# EAGLE design hw2 (EAGLE 8.7.1)
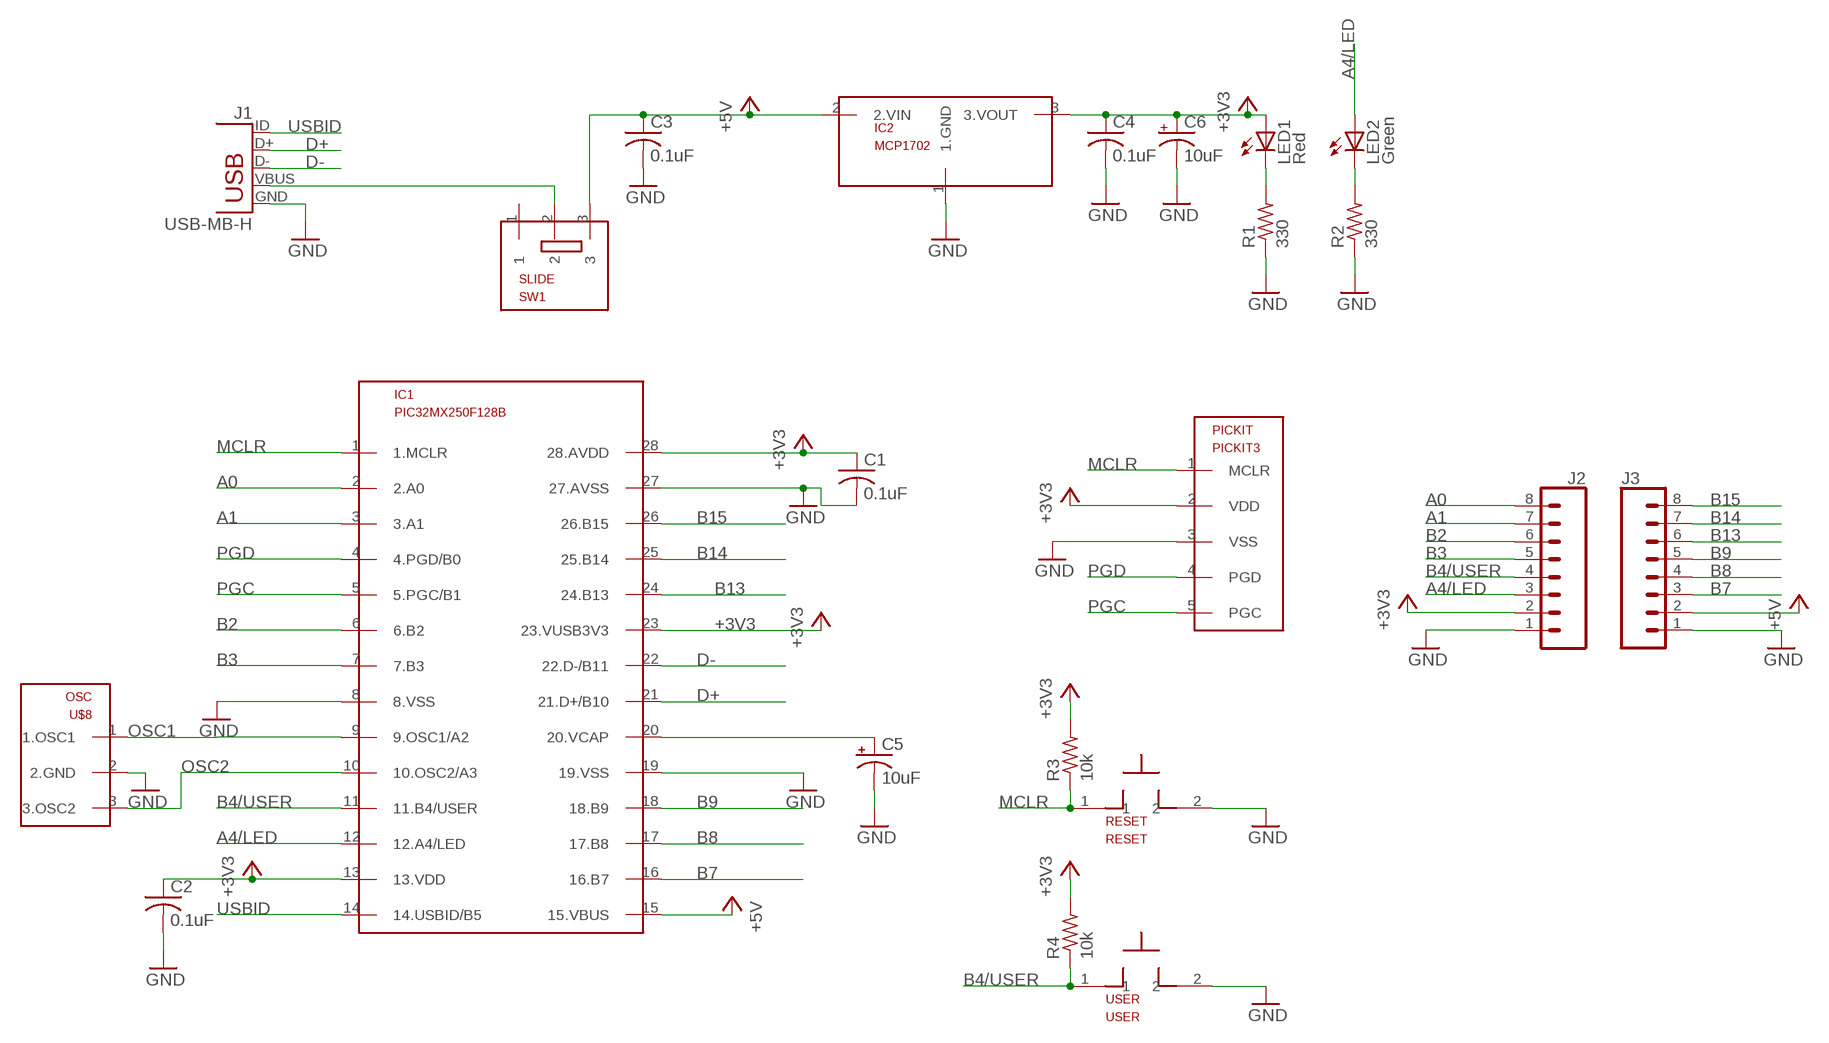
[diagram p0: schematic, sheet 1]

## Parts
C1  0.1uF  C-US025-025X050  [C025-025X050]
C2  0.1uF  C-US025-025X050  [C025-025X050]
C3  0.1uF  C-US025-025X050  [C025-025X050]
C4  0.1uF  C-US025-025X050  [C025-025X050]
C5  10uF  CPOL-USB45181B  [B45181B]
C6  10uF  CPOL-USB45181B  [B45181B]
IC1  PIC32MX250F128B  [DIL28-3]
IC2  MCP1702  [TO92]
J1  USB-MB-H  [USB-MB-H]
J2  CONN_08"  [1X08]
J3  CONN_08"  [1X08]
LED1  Red  LED3MM  [LED3MM]
LED2  Green  LED3MM  [LED3MM]
PICKIT  PICKIT3  [1X05]
R1  330  R-US_0207/10  [0207/10]
R2  330  R-US_0207/10  [0207/10]
R3  10k  R-US_0207/10  [0207/10]
R4  10k  R-US_0207/10  [0207/10]
RESET  RESET  PB  [PB]
SW1  SLIDE  [SLIDE]
U$8  OSC  [OSC]
USER  USER  PB  [PB]

## Nets
+3V3: C1.1 C2.1 C4.1 C6.+ IC1.13(13.VDD) IC1.23(23.VUSB3V3) IC1.28(28.AVDD) IC2.3(3.VOUT) J2.2 LED1.A PICKIT.2(VDD) R3.2 R4.2
+5V: C3.1 IC1.15(15.VBUS) IC2.2(2.VIN) J3.2 SW1.3
A0: IC1.2(2.A0) J2.8
A1: IC1.3(3.A1) J2.7
A4/LED: IC1.12(12.A4/LED) J2.3 LED2.A
B2: IC1.6(6.B2) J2.6
B3: IC1.7(7.B3) J2.5
B4/USER: IC1.11(11.B4/USER) J2.4 R4.1 USER.1
B7: IC1.16(16.B7) J3.3
B8: IC1.17(17.B8) J3.4
B9: IC1.18(18.B9) J3.5
B13: IC1.24(24.B13) J3.6
B14: IC1.25(25.B14) J3.7
B15: IC1.26(26.B15) J3.8
D+: IC1.21(21.D+/B10) J1.D+
D-: IC1.22(22.D-/B11) J1.D-
GND: C1.2 C2.2 C3.2 C4.2 C5.- C6.- IC1.8(8.VSS) IC1.19(19.VSS) IC1.27(27.AVSS) IC2.1(1.GND) J1.GND J2.1 J3.1 PICKIT.3(VSS) R1.1 R2.1 RESET.2 U$8.2(2.GND) USER.2
MCLR: IC1.1(1.MCLR) PICKIT.1(MCLR) R3.1 RESET.1
N$3: J1.VBUS SW1.2
N$5: LED1.K(C) R1.2
N$6: LED2.K(C) R2.2
N$28: C5.+ IC1.20(20.VCAP)
OSC1: IC1.9(9.OSC1/A2) U$8.1(1.OSC1)
OSC2: IC1.10(10.OSC2/A3) U$8.3(3.OSC2)
PGC: IC1.5(5.PGC/B1) PICKIT.5(PGC)
PGD: IC1.4(4.PGD/B0) PICKIT.4(PGD)
USBID: IC1.14(14.USBID/B5) J1.ID
Unconnected: SW1.1

## Library data of the parts
C1-C4 = hw2:C-US: CAPACITOR, American symbol
C5 C6 = hw2:CPOL-US: POLARIZED CAPACITOR, American symbol
IC1 = hw2:PIC32MX250F128B
IC2 = hw2:MCP1702
J1 = hw2:USB: USB Connectors USB-B-PTH is fully proven SKU : PRT-00139/CONN-08278 USB-miniB is fully proven SKU : PRT-00587 USB-A-PCB is untested. USB-A-H is throughly reviewed, but untested. Spark Fun Electronics SKU : PRT-00437 USB-B-SMT is throughly reviewed, but untested. Needs silkscreen touching up. USB-A-S has not been used/tested USB-MB-H has not been used/tested USB-MICROB has been used. CONN-09505
J2 J3 = hw2:CONN_08: Multi connection point. Often used as Generic Header-pin footprint for 0.1 inch spaced/style header connections On any of the 0.1 inch spaced packages, you can populate with these: Break Away Headers - Straight <https://www.sparkfun.com/products/116> (PRT-00116) Break Away Male Headers - Right Angle <https://www.sparkfun.com/products/553> (PRT-00553) Female Headers <https://www.sparkfun.com/products/115> (PRT-00115) Break Away Headers - Machine Pin <https://www.sparkfun.com/products/117> (PRT-00117) Break Away Female Headers - Swiss Machine Pin <https://www.sparkfun.com/products/743> (PRT-00743) Arduino Stackable Header - 8 Pin <https://www.sparkfun.com/products/9279> (PRT-09279) For SCREWTERMINALS and SPRING TERMINALS visit here: Screw Terimnals on SparkFun.com <https://www.sparkfun.com/search/results?term=Screw+Terminals> (5mm/3.5mm/2.54mm spacing) This device is also useful as a general connection point to wire up your design to another part of your project. Our various solder wires solder well into these plated through hole pads. Hook-Up Wire - Assortment (Stranded, 22 AWG) <https://www.sparkfun.com/products/11375> (PRT-11375) Hook-Up Wire - Assortment (Solid Core, 22 AWG) <https://www.sparkfun.com/products/11367> (PRT-11367) View the entire wire category on our website here <https://www.sparkfun.com/categories/141> Special notes: Molex polarized connector foot print use with SKU : PRT-08231 with associated crimp pins and housings. 1MM SMD Version SKU: PRT-10208 NOTES ON THE VARIANTS LOCK and LOCK_LONGPADS... This footprint was designed to help hold the alignment of a through-hole component (i.e. 6-pin header) while soldering it into place. You may notice that each hole has been shifted either up or down by 0.005 of an inch from it's more standard position (which is a perfectly straight line). This slight alteration caused the pins (the squares in the middle) to touch the edges of the holes. Because they are alternating, it causes a "brace" to hold the component in place. 0.005 has proven to be the perfect amount of "off-center" position when using our standard breakaway headers. Although looks a little odd when you look at the bare footprint, once you have a header in there, the alteration is very hard to notice. Also,if you push a header all the way into place, it is covered up entirely on the bottom side.; PROD_ID: CONN-08438
LED1 LED2 = hw2:LED: LED OSRAM: - CHIPLED LG R971, LG N971, LY N971, LG Q971, LY Q971, LO R971, LY R971 LH N974, LH R974 LS Q976, LO Q976, LY Q976 LO Q996 - Hyper CHIPLED LW Q18S LB Q993, LB Q99A, LB R99A - SideLED LS A670, LO A670, LY A670, LG A670, LP A670 LB A673, LV A673, LT A673, LW A673 LH A674 LY A675 LS A676, LA A676, LO A676, LY A676, LW A676 LS A679, LY A679, LG A679 - Hyper Micro SIDELED® LS Y876, LA Y876, LO Y876, LY Y876 LT Y87S - SmartLED LW L88C, LW L88S LB L89C, LB L89S, LG L890 LS L89K, LO L89K, LY L89K LS L896, LA L896, LO L896, LY L896 - TOPLED LS T670, LO T670, LY T670, LG T670, LP T670 LSG T670, LSP T670, LSY T670, LOP T670, LYG T670 LG T671, LOG T671, LSG T671 LB T673, LV T673, LT T673, LW T673 LH T674 LS T676, LA T676, LO T676, LY T676, LB T676, LH T676, LSB T676, LW T676 LB T67C, LV T67C, LT T67C, LS T67K, LO T67K, LY T67K, LW E67C LS E67B, LA E67B, LO E67B, LY E67B, LB E67C, LV E67C, LT E67C LW T67C LS T679, LY T679, LG T679 LS T770, LO T770, LY T770, LG T770, LP T770 LB T773, LV T773, LT T773, LW T773 LH T774 LS E675, LA E675, LY E675, LS T675 LS T776, LA T776, LO T776, LY T776, LB T776 LHGB T686 LT T68C, LB T68C - Hyper Mini TOPLED® LB M676 - Mini TOPLED Santana® LG M470 LS M47K, LO M47K, LY M47K Source: http://www.osram.convergy.de LUXEON: - LUMILED® LXK2-PW12-R00, LXK2-PW12-S00, LXK2-PW14-U00, LXK2-PW14-V00 LXK2-PM12-R00, LXK2-PM12-S00, LXK2-PM14-U00 LXK2-PE12-Q00, LXK2-PE12-R00, LXK2-PE12-S00, LXK2-PE14-T00, LXK2-PE14-U00 LXK2-PB12-K00, LXK2-PB12-L00, LXK2-PB12-M00, LXK2-PB14-N00, LXK2-PB14-P00, LXK2-PB14-Q00 LXK2-PR12-L00, LXK2-PR12-M00, LXK2-PR14-Q00, LXK2-PR14-R00 LXK2-PD12-Q00, LXK2-PD12-R00, LXK2-PD12-S00 LXK2-PH12-R00, LXK2-PH12-S00 LXK2-PL12-P00, LXK2-PL12-Q00, LXK2-PL12-R00 Source: www.luxeon.com KINGBRIGHT: KA-3528ASYC Source: www.kingbright.com
PICKIT = hw2:PICKIT3
R1-R4 = hw2:R-US_: RESISTOR, American symbol
RESET USER = hw2:PB
SW1 = hw2:SLIDE
U$8 = hw2:OSC

## Board
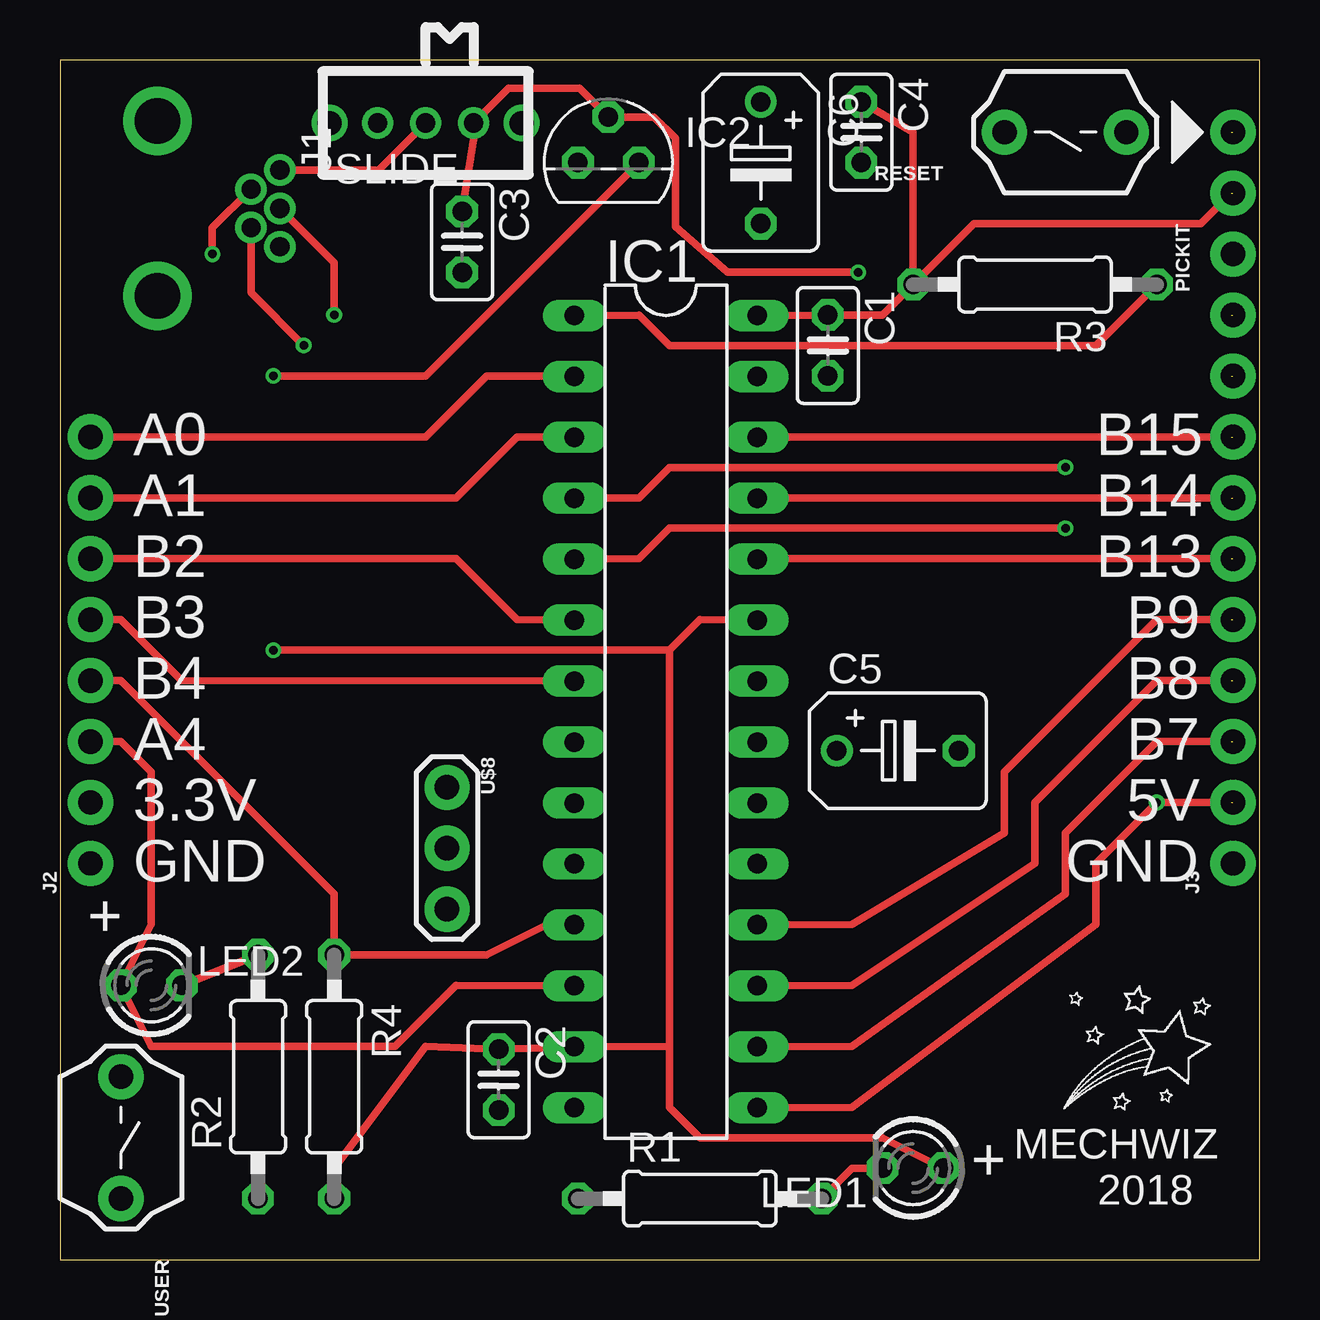
[diagram p1: board, top side]
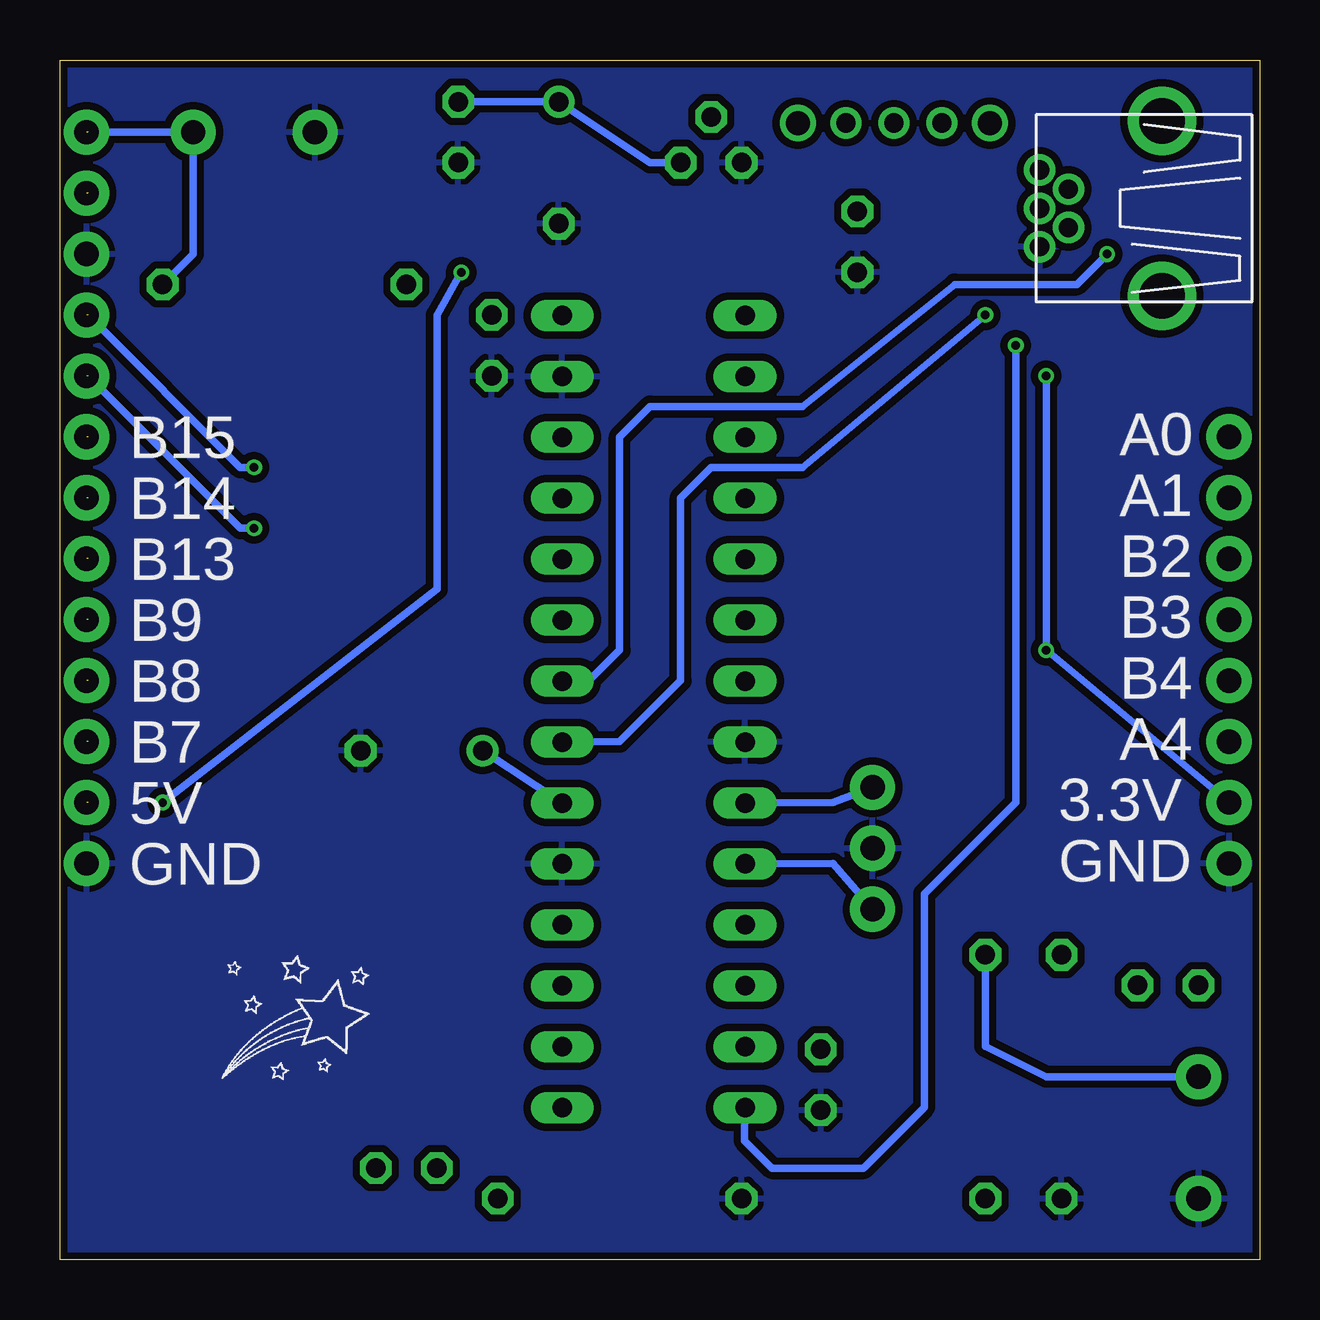
[diagram p2: board, bottom side, seen from below]

Size 50 x 50 mm. Coordinates in mm from the lower left corner, seen from the top.
Outline: 0,0 50,0 50,50 0,50 0,0
Copper layers (1*16): Top 0.035mm / dielectric 1.5mm / Bottom 0.035mm
Design rules "SeeedStudio_2layer_DRU_no_angle_20140221": minimum track width 6mil, minimum drill 12mil, track to track 6mil, track to pad 6mil, pad to pad 6mil, via to via 6mil, smd to smd 0mil, copper to edge 10mil, drill to drill 10mil, minimum pad ring 10mil, minimum via ring 6mil, stop-mask expansion 2mil, vias tented up to drill 100mil, thermal gap 10mil

### Footprints (pad centres in the part's own frame; a part is rotated, then mirrored left to right if it is on the bottom)
C025-025X050 = drill 0.813 octagon: 1 -1.27,0; 2 1.27,0
B45181B = drill 0.813: + -2.54,0 | drill 0.813 octagon: - 2.54,0
DIL28-3 = drill 0.813 long: 1 -16.51,-3.81; 2 -13.97,-3.81; 3 -11.43,-3.81; 4 -8.89,-3.81; 5 -6.35,-3.81; 6 -3.81,-3.81; 7 -1.27,-3.81; 8 1.27,-3.81; 9 3.81,-3.81; 10 6.35,-3.81; 11 8.89,-3.81; 12 11.43,-3.81; 13 13.97,-3.81; 14 16.51,-3.81; 15 16.51,3.81; 16 13.97,3.81; 17 11.43,3.81; 18 8.89,3.81; 19 6.35,3.81; 20 3.81,3.81; 21 1.27,3.81; 22 -1.27,3.81; 23 -3.81,3.81; 24 -6.35,3.81; 25 -8.89,3.81; 26 -11.43,3.81; 27 -13.97,3.81; 28 -16.51,3.81
TO92 = drill 0.813 octagon: 1 -1.27,0; 2 0,1.905; 3 1.27,0
USB-MB-H = drill 0.8: D+ 5.1,0; D- 3.9,0.8; GND 5.1,-1.6; ID 3.9,-0.8; VBUS 5.1,1.6 | drill 1.9: P$6 0,-3.65; P$7 0,3.65
1X08 = drill 1.016 pad 1.88: 1 0,0; 2 2.54,0; 3 5.08,0; 4 7.62,0; 5 10.16,0; 6 12.7,0; 7 15.24,0; 8 17.78,0
LED3MM = drill 0.813 octagon: A -1.27,0; K 1.27,0
1X05 = drill 1.016 pad 1.88: 1 0,0; 2 2.54,0; 3 5.08,0; 4 7.62,0; 5 10.16,0
0207/10 = drill 0.813 octagon: 1 -5.08,0; 2 5.08,0
PB = drill 1.016 pad 1.88: 1 -2.54,0; 2 2.54,0
SLIDE = drill 0.8: 1 -2,0; 2 0,0; 3 2,0 | drill 1: P$1 -4,0; P$2 4,0
OSC = drill 1.016 pad 1.88: 1 -2.54,0; 2 0,0; 3 2.54,0

### Placement (x,y rotation side)
C1  32,38.1 270 top
C2  18.29,7.49 270 top
C3  16.76,42.42 270 top
C4  33.4,46.99 270 top
C5  34.92,21.21 0 top
C6  29.21,45.72 270 top
IC1  25.25,22.84 270 top
IC2  22.86,45.72 0 top
J1  4.06,43.81 0 top
J2  1.27,16.51 90 top
J3  48.9,16.51 90 top
LED1  35.56,3.81 180 top
LED2  3.81,11.43 0 top
PICKIT  48.9,46.99 270 top
R1  26.67,2.54 0 top
R2  8.26,7.62 90 top
R3  40.64,40.64 180 top
R4  11.43,7.62 270 top
RESET  41.91,46.99 180 top
SW1  15.24,47.37 0 top
U$8  16.13,17.14 270 top
USER  2.54,5.08 270 top

### Tracks (layer width: path | path; a pad name or v marks a point on that pad's centre or on a via)
+3V3  (via drill 0.35)  (1 unrouted)
  Top 0.305: R4.2 11.43,3.81 15.24,8.89 C2.1 IC1.13 25.4,8.89 | 25.4,8.89 25.4,6.35 26.67,5.08 34.29,5.08 LED1.A | 25.4,8.89 25.4,25.4 | 25.4,25.4 26.67,26.67 IC1.23 | v8.89,25.4 25.4,25.4 | IC1.28 C1.1 34.29,39.37 R3.2 | R3.2 38.1,43.18 47.56,43.18 48.83,44.45 | v8.89,36.83 15.24,36.83 IC2.3 | C4.1 35.56,46.99 R3.2
  Bottom 0.305: J2.2 v8.89,25.4 v8.89,36.83 | IC2.3 25.4,45.72 C6.+ C4.1
+5V  (via drill 0.35)  (1 unrouted)
  Top 0.305: IC1.15 33.02,6.35 43.18,13.97 43.18,16.51 v45.72,19.05 48.83,19.05 | v33.27,41.15 27.81,41.15 25.65,43.05 25.65,46.74 24.77,47.62 IC2.2 21.65,48.83 18.7,48.83 SW1.3 17.27,46.96 C3.1
  Bottom 0.305: v45.72,19.05 34.29,27.94 34.29,39.37 v33.27,41.15
A0
  Top 0.305: J2.8 15.24,34.29 17.78,36.83 21.43,36.83 IC1.2
A1
  Top 0.305: J2.7 16.51,31.75 19.05,34.29 IC1.3
A4/LED
  Top 0.305: J2.3 2.54,21.59 3.81,20.32 3.81,13.97 LED2.A 3.81,8.89 13.97,8.89 16.51,11.43 IC1.12
B2
  Top 0.305: J2.6 16.51,29.21 19.05,26.67 IC1.6
B3
  Top 0.305: J2.5 2.54,26.67 5.08,24.13 IC1.7
B4/USER
  Top 0.305: J2.4 2.54,24.13 11.43,15.24 R4.1 17.78,12.7 20.32,13.97 IC1.11
  Bottom 0.305: 7.62,7.62 USER.1 8.89,7.62 11.43,8.89 R4.1
B7  (1 unrouted)
  Top 0.305: IC1.16 33.02,8.89 41.91,15.24 41.91,17.78 45.72,21.59 48.83,21.59
B8  (1 unrouted)
  Top 0.305: IC1.17 33.02,11.43 40.64,16.51 40.64,19.05 45.72,24.13 48.83,24.13
B9  (1 unrouted)
  Top 0.305: IC1.18 33.02,13.97 39.37,17.78 39.37,20.32 45.72,26.67 48.83,26.67
B13  (1 unrouted)
  Top 0.305: IC1.24 29.08,29.21 48.83,29.21
B14  (1 unrouted)
  Top 0.305: IC1.25 29.08,31.75 48.83,31.75
B15  (1 unrouted)
  Top 0.305: IC1.26 29.21,34.29 48.83,34.29
D+  (via drill 0.35)
  Top 0.305: v11.43,39.37 11.43,41.55 J1.D+
  Bottom 0.305: IC1.21 26.67,21.59 24.13,24.13 24.13,31.75 22.86,33.02 19.05,33.02 v11.43,39.37
D-  (via drill 0.35)
  Top 0.305: v6.35,41.91 6.35,43 J1.D-
  Bottom 0.305: IC1.22 27.94,24.13 26.67,25.4 26.67,34.29 25.4,35.56 19.05,35.56 12.7,40.64 7.62,40.64 v6.35,41.91
GND
  pour Bottom (isolate 0.305): -0.38,50.29 50.42,50.29 50.42,-0.38 -0.25,-0.38 -0.38,-0.51
MCLR  (1 unrouted)
  Top 0.305: IC1.1 24.13,39.37 25.4,38.1 43.18,38.1 R3.1
  Bottom 0.305: R3.1 44.45,41.91 RESET.1 48.83,46.99
N$3
  Top 0.305: J1.VBUS 13.28,45.41 SW1.2
N$5
  Top 0.305: R1.2 33.02,3.81 LED1.K
N$6
  Top 0.305: LED2.K R2.2
N$28
  Bottom 0.305: IC1.20 C5.+
OSC1
  Bottom 0.305: IC1.9 17.78,19.05 U$8.1
OSC2
  Bottom 0.305: IC1.10 17.78,16.51 U$8.3
PGC  (via drill 0.35)  (1 unrouted)
  Top 0.305: IC1.5 24.13,29.21 25.4,30.48 v41.91,30.48
  Bottom 0.305: v41.91,30.48 42.48,30.48 48.83,36.83
PGD  (via drill 0.35)  (1 unrouted)
  Top 0.305: IC1.4 24.13,31.75 25.4,33.02 v41.91,33.02
  Bottom 0.305: v41.91,33.02 42.48,33.02 48.83,39.37
USBID  (via drill 0.35)
  Top 0.305: v10.16,38.1 7.96,40.3 J1.ID
  Bottom 0.305: IC1.14 21.46,4.95 20.32,3.81 16.51,3.81 13.97,6.35 13.97,15.24 10.16,19.05 v10.16,38.1

### Text on the board
tPlace: A0 | B15 | A1 | B14 | B2 | B13 | B3 | B9 | B4 | B8 | A4 | B7 | 3.3V | 5V | GND | GND | + | + | MECHWIZ / 2018
bPlace: A0 | B15 | A1 | B14 | B2 | B13 | B3 | B9 | B4 | B8 | A4 | B7 | 3.3V | 5V | GND | GND